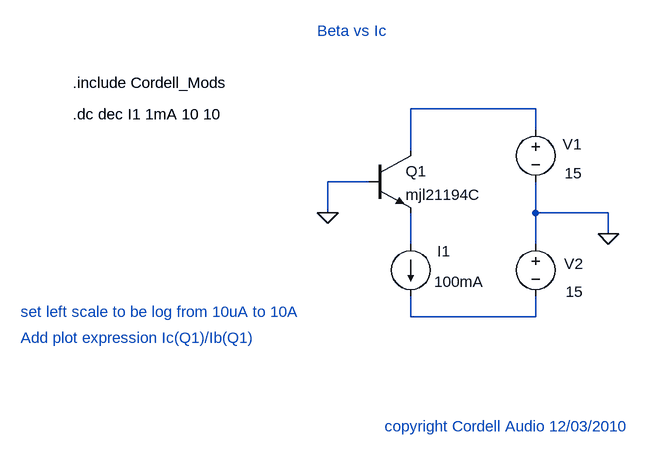
[diagram p0: schematic Beta vs Ic.asc]
Beta vs Ic.asc, the LTspice schematic file:
Version 4
SHEET 1 880 700
WIRE 192 192 0 192
WIRE 192 224 192 192
WIRE 0 256 0 192
WIRE -64 304 -128 304
WIRE -128 352 -128 304
WIRE 192 352 192 304
WIRE 304 352 192 352
WIRE 304 384 304 352
WIRE 0 400 0 352
WIRE 192 400 192 352
WIRE 0 512 0 480
WIRE 192 512 192 480
WIRE 192 512 0 512
FLAG 304 384 0
FLAG -128 352 0
SYMBOL voltage 192 208 R0
WINDOW 123 0 0 Left 0
WINDOW 39 0 0 Left 0
WINDOW 0 42 38 Left 0
WINDOW 3 45 83 Left 0
SYMATTR InstName V1
SYMATTR Value 15
SYMBOL npn -64 256 R0
SYMATTR InstName Q1
SYMATTR Value mjl21194C
SYMBOL current 0 400 R0
WINDOW 123 0 0 Left 0
WINDOW 39 0 0 Left 0
WINDOW 0 41 11 Left 0
WINDOW 3 36 58 Left 0
SYMATTR InstName I1
SYMATTR Value 100mA
SYMBOL voltage 192 384 R0
WINDOW 123 0 0 Left 0
WINDOW 39 0 0 Left 0
WINDOW 0 44 46 Left 0
WINDOW 3 46 89 Left 0
SYMATTR InstName V2
SYMATTR Value 15
TEXT -144 72 Left 0 ;Beta vs Ic
TEXT -520 200 Left 0 !.dc dec I1 1mA 10 10
TEXT -600 504 Left 0 ;set left scale to be log from 10uA to 10A
TEXT -600 544 Left 0 ;Add plot expression Ic(Q1)/Ib(Q1)
TEXT -520 152 Left 0 !.include Cordell_Mods
TEXT -40 680 Left 0 ;copyright Cordell Audio 12/03/2010

The netlist it stands for:
* Beta vs Ic.asc
V1 N001 0 15
Q1 N001 0 N002 0 mjl21194C
I1 N002 N003 100mA
V2 0 N003 15
.model NPN NPN
.model PNP PNP
.lib standard.bjt
* Beta vs Ic
.dc dec I1 1mA 10 10
* set left scale to be log from 10uA to 10A
* Add plot expression Ic(Q1)/Ib(Q1)
.include Cordell_Mods
* copyright Cordell Audio 12/03/2010
.backanno
.end